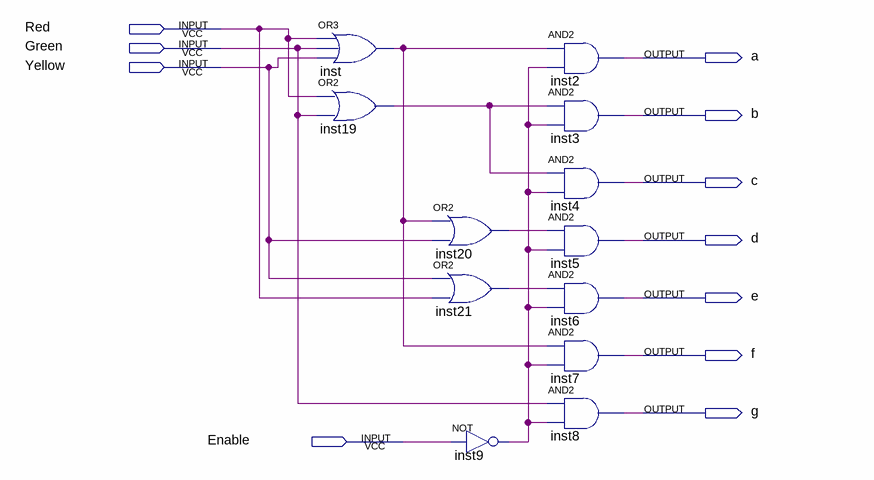
[diagram p0: schematic sheet]
// Quartus schematic FNDarray0.bdf as structural Verilog: 12 symbols, 11 pins
module FNDarray0 (
  input  Red,
  input  Green,
  input  Yellow,
  input  Enable,
  output a,
  output b,
  output c,
  output d,
  output e,
  output f,
  output g
);

  wire inst9_out, inst19_out, inst20_out, inst21_out, inst_out;

  or inst (inst_out, Red, Green, Yellow);
  or inst19 (inst19_out, Red, Green);
  or inst20 (inst20_out, inst_out, Yellow);
  or inst21 (inst21_out, Yellow, Red);
  not inst9 (inst9_out, Enable);
  and inst2 (a, inst_out, inst9_out);
  and inst3 (b, inst19_out, inst9_out);
  and inst4 (c, inst19_out, inst9_out);
  and inst5 (d, inst20_out, inst9_out);
  and inst6 (e, inst21_out, inst9_out);
  and inst7 (f, inst_out, inst9_out);
  and inst8 (g, Green, inst9_out);
endmodule
